# EAGLE design camera (EAGLE 7.1.0)
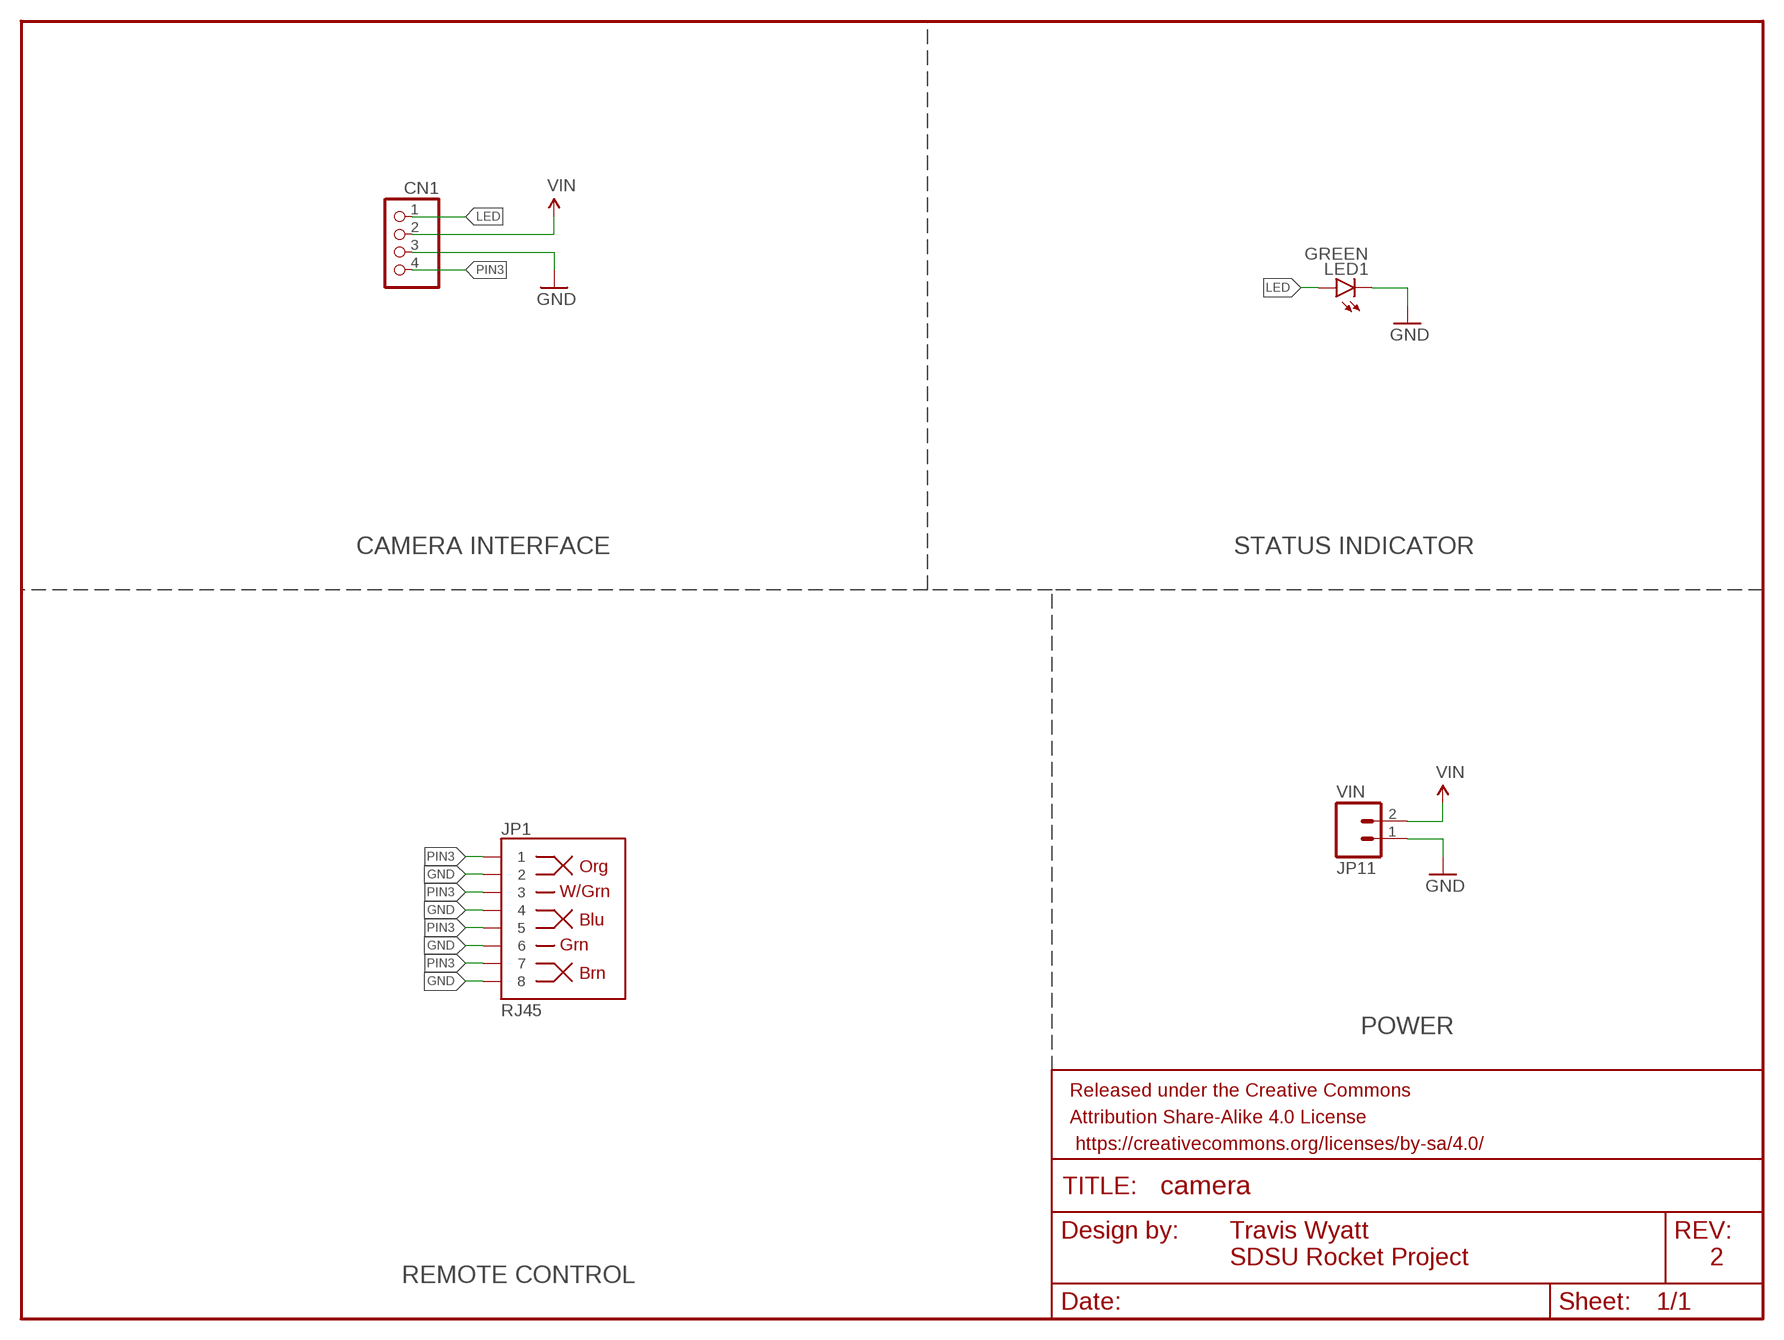
[diagram p0: schematic, sheet 1]

## Parts
CN1  JST_4PIN  [JSTPH4]
FRAME1  FRAME-LETTER  [CREATIVE_COMMONS]
JP1  RJ45  RJ45-8PTH  [RJ45-8]
JP11  VIN  M02-JST-2MM-SMT  [JST-2-SMD]
LED1  GREEN  LED-GREEN0603  [LED-0603]

## Nets
GND: CN1.3 JP1.2 JP1.4 JP1.6 JP1.8 JP11.1 LED1.C
LED: CN1.1 LED1.A
PIN3: CN1.4 JP1.1 JP1.3 JP1.5 JP1.7
VIN: CN1.2 JP11.2

## Notes on the sheet
- CAMERA INTERFACE | STATUS INDICATOR
- POWER
- Travis Wyatt
- SDSU Rocket Project
- 2
- REMOTE CONTROL

## Library data of the parts
CN1 = microbuilder_v2:JST_4PIN: JST 4-Pin Right-Angle Connector 4UConnector: 17312
FRAME1 = SparkFun-Aesthetics:FRAME-LETTER: Schematic Frame Standard 8.5x11 US Letter frame; DESIGNER: NAME; VERSION: v01
JP1 = SparkFun-Connectors:RJ45-8: RJ45 Jack Simple RJ45, 8-pin connection - connector for common Cat5, Cat5e, and Cat6 Ethernet cables. Footprint not yet proven in production. Connector sku is PRT-00643; Breakout PCB sku is BOB-00716.; PROD_ID: CONN-08506
JP11 = SparkFun-Connectors:M02: Standard 2-pin 0.1" header. Use with - straight break away headers ( PRT-00116) - right angle break away headers (PRT-00553) - swiss pins (PRT-00743) - machine pins (PRT-00117) - female headers (PRT-00115) Molex polarized connector foot print use with: PRT-08233 with associated crimp pins and housings. 2.54_SCREWTERM for use with PRT-10571. 3.5mm Screw Terminal footprints for PRT-08084 5mm Screw Terminal footprints for use with PRT-08432; PROD_ID: CONN-08352
LED1 = SparkFun-LED:LED-GREEN: Various green LEDs Green LEDs used in SFE Production 0603- DIO-00821 LARGE- DIO-00862 LILYPAD- DIO-09910; PROD_ID: DIO-00821

## Board
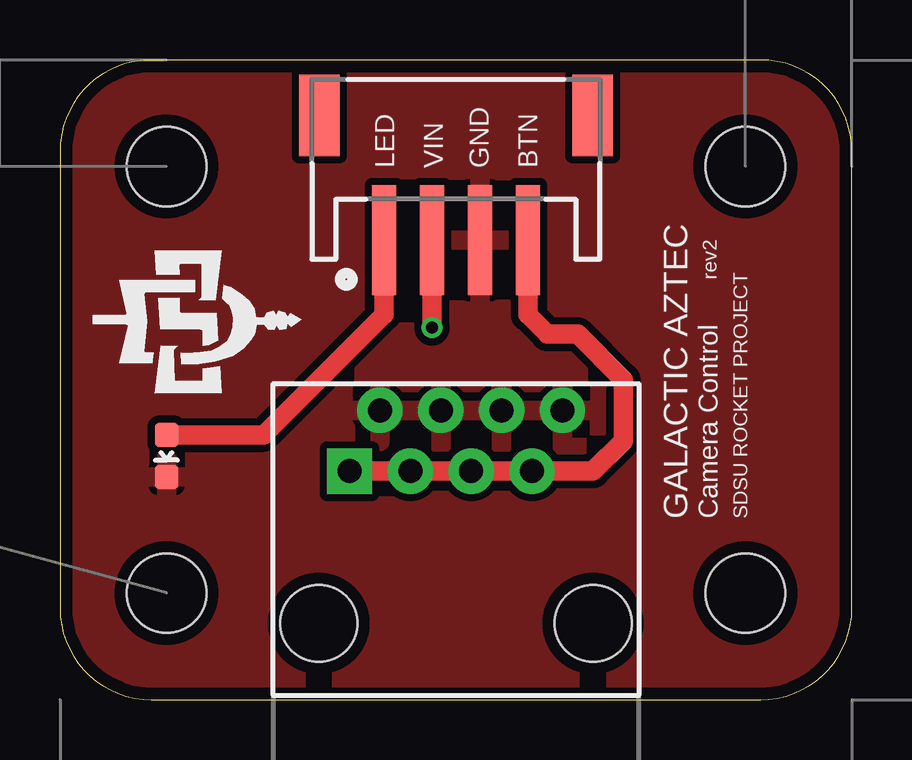
[diagram p1: board, top side]
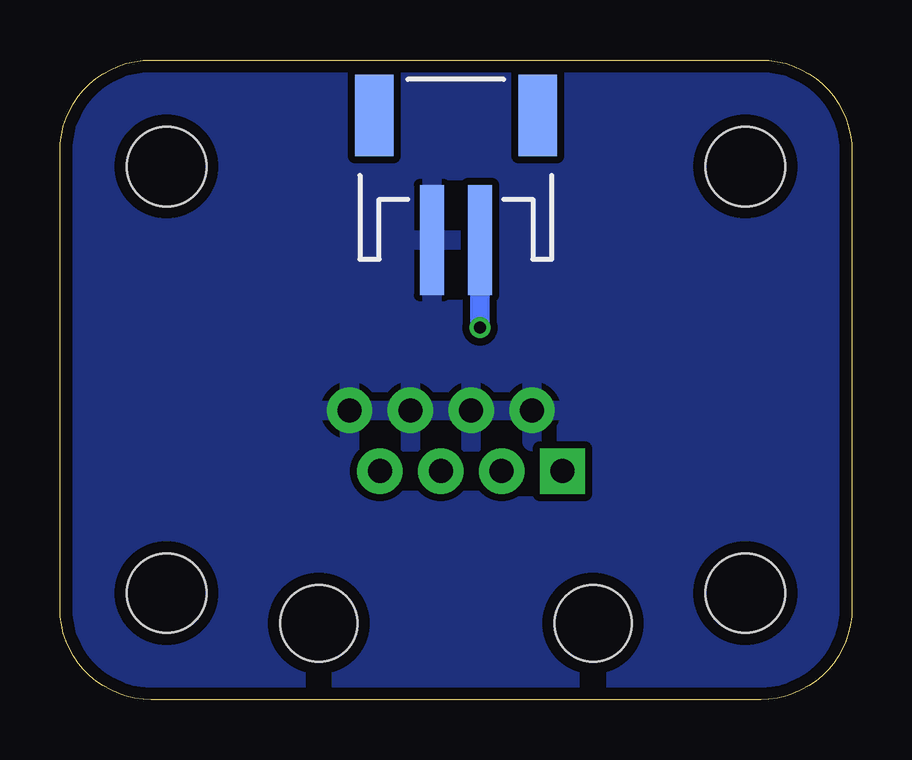
[diagram p2: board, bottom side, seen from below]

Size 33.02 x 26.67 mm. Coordinates in mm from the lower left corner, seen from the top.
Outline: 0,22.86 0,3.81 arc90 3.81,0 29.21,0 arc90 33.02,3.81 33.02,22.86 arc90 29.21,26.67 3.81,26.67 arc90 0,22.86
Copper layers (1*16): Top 0.0356mm / dielectric 1.5011mm / Bottom 0.0356mm
Design rules "SparkFunBestPractices *": minimum track width 14mil, minimum drill 13mil, track to track 12mil, track to pad 12mil, pad to pad 12mil, via to via 12mil, smd to smd 12mil, copper to edge 20mil, drill to drill 14mil, minimum pad ring 7mil, minimum via ring 7mil, stop-mask expansion 3mil, vias tented up to drill 0mil, thermal gap 10mil

### Footprints (pad centres in the part's own frame; a part is rotated, then mirrored left to right if it is on the bottom)
JSTPH4 = smd 1 x 4.6: 1 -3,-3.7; 2 -1,-3.7; 3 1,-3.7; 4 3,-3.7 | smd 1.7 x 3.4: NC1 -5.7,1.5; NC2 5.7,1.5
RJ45-8 = drill 1 pad 1.88 square: 1 -4.445,6.35 | drill 1 pad 1.88: 2 -3.175,8.89; 3 -1.905,6.35; 4 -0.635,8.89; 5 0.635,6.35; 6 1.905,8.89; 7 3.175,6.35; 8 4.445,8.89 | hole 3.2: -5.715,0; 5.715,0
JST-2-SMD = smd 1 x 4.6: 1 -1,-3.7; 2 1,-3.7 | smd 1.6 x 3.4: NC1 -3.4,1.5; NC2 3.4,1.5
LED-0603 = smd 1 x 1: A 0,-0.877; C 0,0.877
STAND-OFF = hole 3.302: 0,0

### Placement (x,y rotation side)
CN1  16.51,22.86 0 top
FRAME1  0,-30.48 0 top  (outside the outline)
JP1  16.51,3.17 0 top
JP11  16.51,22.86 0 bottom
LED1  4.45,10.16 180 top
U$1  [STAND-OFF]  4.45,22.23 0 top
U$2  [STAND-OFF]  4.45,4.45 0 top
U$3  [STAND-OFF]  28.57,4.45 0 top
U$4  [STAND-OFF]  28.57,22.23 0 top

### Tracks (layer width: path | path; a pad name or v marks a point on that pad's centre or on a via)
GND
  pour Bottom: 0,0 0,26.67 33.02,26.67 33.02,0
  pour Top: 0,0 0,26.67 33.02,26.67 33.02,0
LED
  Top 0.813: LED1.A 8.5,11.04 13.51,16.05 CN1.1
PIN3
  Top 0.813: CN1.4 19.51,16.05 20.32,15.24 21.59,15.24 23.5,13.34 23.5,10.79 22.23,9.53 JP1.7 JP1.5 JP1.3 JP1.1
VIN  (via drill 0.51)
  Top 0.813: CN1.2 v15.51,15.51
  Bottom 0.813: v15.51,15.51 CN1.2

### Text on the board
tNames: LED | VIN | GND | BTN | rev2 | GALACTIC AZTEC | Camera Control | SDSU ROCKET PROJECT
tDocu: ø0.13